# Altium schematic sheet USBFX2LP_1.SchDoc: USBFX-1
size A; Revision: 04
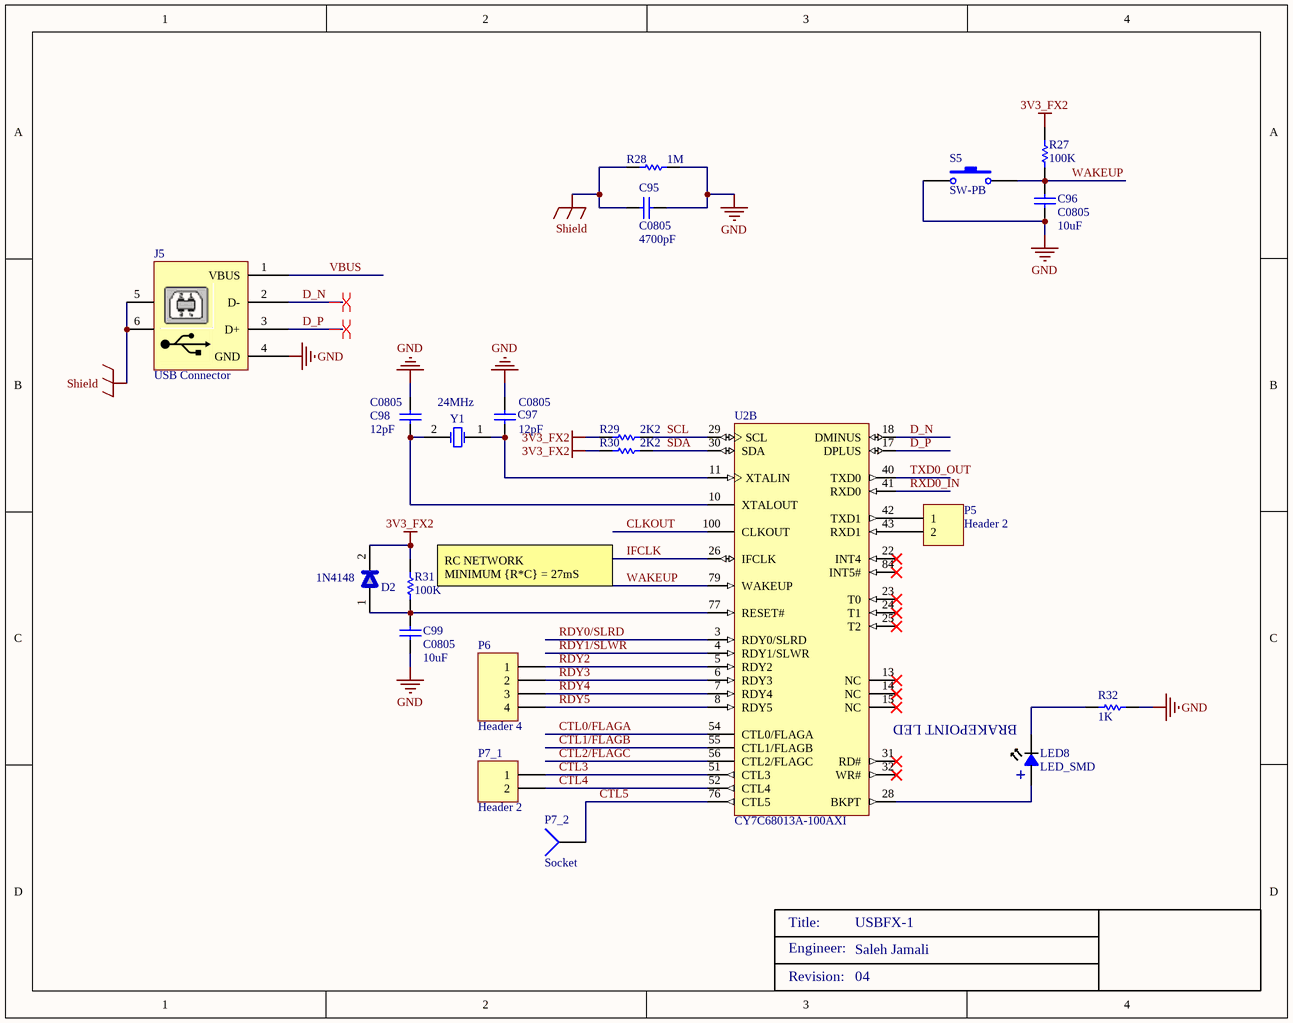
[diagram p0: USBFX2LP_1.SchDoc]

## Parts
C95  C0805  value 4700pF  [0805]
C96  C0805  value 10uF  [0805]
C97  C0805  value 12pF  [0805]
C98  C0805  value 12pF  [0805]
C99  C0805  value 10uF  [0805]
D2  1N4148  [MELF35]
J5  USB Connector  [USB2.5-2H4E]
LED8  LED_SMD  [LED_805]
P5  Header 2  [HDR1X2]
P6  Header 4  [HDR1X4]
P7_1  Header 2  [HDR1X2]
P7_2  Socket  [PIN1]
R27  100K  [ERA-0805]
R28  1M  [ERA-0805]
R29  2K2  [ERA-0805]
R30  2K2  [ERA-0805]
R31  100K  [ERA-0805]
R32  1K  [ERA-0805]
S5  SW-PB  [SPST-2]
U2  CY7C68013A-100AXI  [CYP-AX100RA_N]  (part B of 3)
Y1  24MHz  [HC-49U]

## Nets
3V3_FX2: D2.2 R27.1 R29.2 R30.2 R31.1
GND: C95.2 C96.1 C97.1 C98.1 C99.1 J5.4(GND) R28.1 R32.2 S5.1
Shield: C95.1 J5.5 J5.6 R28.2
CLKOUT: U2.100(CLKOUT)
CTL0/FLAGA: U2.54(CTL0/FLAGA)
CTL1/FLAGB: U2.55(CTL1/FLAGB)
CTL2/FLAGC: U2.56(CTL2/FLAGC)
CTL3: P7_1.1 U2.51(CTL3)
CTL4: P7_1.2 U2.52(CTL4)
CTL5: P7_2.1 U2.76(CTL5)
D_N: J5.2(D-) U2.18(DMINUS)
D_P: J5.3(D+) U2.17(DPLUS)
IFCLK: U2.26(IFCLK)
RDY0/SLRD: U2.3(RDY0/SLRD)
RDY1/SLWR: U2.4(RDY1/SLWR)
RDY2: P6.1 U2.5(RDY2)
RDY3: P6.2 U2.6(RDY3)
RDY4: P6.3 U2.7(RDY4)
RDY5: P6.4 U2.8(RDY5)
RXD0_IN: U2.41(RXD0)
SCL: R29.1 U2.29(SCL)
SDA: R30.1 U2.30(SDA)
TXD0_OUT: U2.40(TXD0)
VBUS: J5.1(VBUS)
WAKEUP: C96.2 R27.2 S5.2 U2.79(WAKEUP)
NetC97_2: C97.2 U2.11(XTALIN) Y1.1(OSC1)
NetC98_2: C98.2 U2.10(XTALOUT) Y1.2(OSC2)
NetC99_2: C99.2 D2.1 R31.2 U2.77(RESET#)
NetLED8_1: LED8.1 U2.28(BKPT)
NetLED8_2: LED8.2 R32.1
NetP5_1: P5.1 U2.42(TXD1)
NetP5_2: P5.2 U2.43(RXD1)

Not connected (* = marked no-connect by the designer): U2 13(NC)* 14(NC)* 15(NC)* 22(INT4)* 23(T0)* 24(T1)* 25(T2)* 31(RD#)* 32(WR#)* 84(INT5#)*

## Layout directives
differential pair: D_N, D_P

## Notes on the sheet
- (near R31) RC NETWORK
  MINIMUM {R*C} = 27mS
- (near LED8) BRAKEPOINT LED
- Engineer:
- Title:
- Saleh Jamali
- Revision:

## Library data of the parts
C95-C99 = C0805: Ceramic Chip Capacitor - Standard; Note: Footprint corresponds to dimensions for bulk cassette packaging. This case size has tightened tolerances.; Published: 17-Jul-2002; LatestRevisionDate: 19-Mar-2004; LatestRevisionNote: Silkscreen size reduced.; DatasheetDocument: Mar-2001; PackageDocument: Mar-2001; PackageReference: 0805; Publisher: Altium Limited; Code_JEITA: 0805; Code_IPC: 2012[0805]; ComponentLink1Description: Manufacturer Link; ComponentLink1URL: http://www.kemet.com/; ComponentLink2Description: Datasheet; ComponentLink2URL: http://www.kemet.com/kemet/web/homepage/kechome.nsf/vapubfilesname/F3102TA.pdf/$file/F3102TA.pdf
D2 = Diode_SMD: melf 35 general purpose diode
J5 = USB: USB Connector-B Type; Designer: Eng. Saeid Jorablo; Company: DASE Co; Adding Date: 10/26/2010
P5 P7_1 = Header 2: Header, 2-Pin; LatestRevisionDate: 17-Jul-2002; LatestRevisionNote: Re-released for DXP Platform.; Publisher: Altium Limited
P6 = Header 4: Header, 4-Pin; LatestRevisionDate: 17-Jul-2002; LatestRevisionNote: Re-released for DXP Platform.; Publisher: Altium Limited
R27-R32 = ERA6Y: Rectangular Thick Film Chip Resistor, 10 Ohm to 1M Ohm Range, 0.1% and 0.5% Tolerance, 0805 Size, 0.1 W; Note: If flow soldering, adjust pad width of PCB Footprint to 0.7 - 0.8 times the width of the resistor.; Published: 17-Dec-2003; LatestRevisionDate: 19-Mar-2004; LatestRevisionNote: Silkscreen size reduced.; PackageDocument: Mar-2003; PackageReference: ERA-0805; Publisher: Altium Limited; Code_IPC: 2012 [0805]; ComponentLink1Description: Manufacturer Link; ComponentLink1URL: http://www.panasonic.com/industrial/components/resistive_products.htm; ComponentLink2Description: Datasheet; ComponentLink2URL: http://www.panasonic.com/industrial/components/pdf/AOA0000CE8.pdf
S5 = SW-PB: Switch; Published: 24-Mar-1999; LatestRevisionDate: 17-Jul-2002; LatestRevisionNote: Re-released for DXP Platform.; PackageReference: SPST-2; Publisher: Altium Limited; PackageDescription: Switch; 2 Leads
U2 = CY7C68013A-100AXI: EZ-USB(R) FX2LP(TM) USB Microcontroller High-Speed USB Peripheral Controller, 16 KB, 40 I/Os, 3 to 3.6 V, -40 to 85 degC, 100-Pin TQFP (AX100RA), Tray; Manufacturer: Cypress; Max. Operating Voltage (V): 3.6; Memory Architecture: RAM; Memory Size (KB): 16; Min. Operating Voltage (V): 3; No. of I/Os: 40; DatasheetVersion: Rev. *W; PackageVersion: Rev. *E; PackageReference: AX100RA; PackageDescription: 100-Pin Thin Quad Flat Pack, Body 14 x 20 mm, Pitch 0.65 mm; Supplier 1: Digi-Key; Supplier Part Number 1: 428-2263-ND; Supplier 2: Farnell; Supplier Part Number 2: 1876347; Supplier 3: Newark; Supplier Part Number 3: 19M7107; Supplier 4: Mouser; Supplier Part Number 4: 727-CYC68013A100AXI; CPU Core: Enhanced 8051; Max. Operating Temp. (degreesC): 85; Min. Operating Temp. (degreesC): -40; Packing: Tray; RoHS: Pb-Free; Mounting Technology: Surface Mount; Code_JEDEC: MS-026; PartNumber: CY7C68013A-100AXI; ComponentLink1Description: Manufacturer URL; ComponentLink1URL: http://www.cypress.com/; ComponentLink2Description: Datasheet; ComponentLink2URL: http://www.cypress.com/?docID=45142; ComponentLink3Description: Package Specification; ComponentLink3URL: http://www.cypress.com/?docID=48215
Y1 = ECS-10-13-1: Crystal Oscillator; Published: 17-Jul-2002; DatasheetDocument: 18-Apr-2000; PackageReference: HC-49U; Publisher: Altium Limited; ComponentLink1Description: Manufacturer Link; ComponentLink1URL: http://www.ecsxtal.com/; ComponentLink2Description: Datasheet; ComponentLink2URL: http://www.ecsxtal.com/pdf2/HC49U.PDF
P7_2 = Socket: LatestRevisionDate: 17-Jul-2002; LatestRevisionNote: Re-released for DXP Platform.; Publisher: Altium Limited